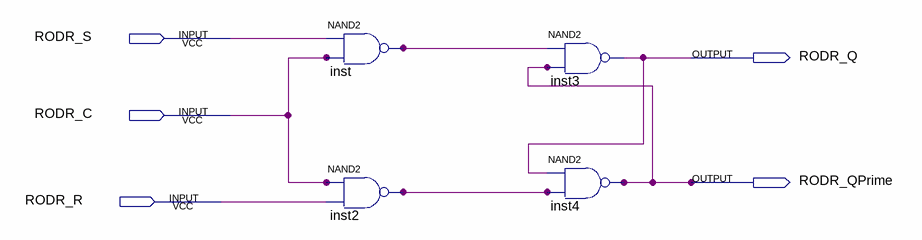
[diagram p0: schematic sheet]
// Quartus schematic RODR_Control_SRLatch.bdf as structural Verilog: 4 symbols, 5 pins
module RODR_Control_SRLatch (
  input  RODR_S,
  input  RODR_C,
  input  RODR_R,
  output RODR_Q,
  output RODR_QPrime
);

  wire inst2_out, inst_out;

  nand inst (inst_out, RODR_S, RODR_C);
  nand inst2 (inst2_out, RODR_C, RODR_R);
  nand inst3 (RODR_Q, inst_out, RODR_QPrime);
  nand inst4 (RODR_QPrime, RODR_Q, inst2_out);
endmodule
